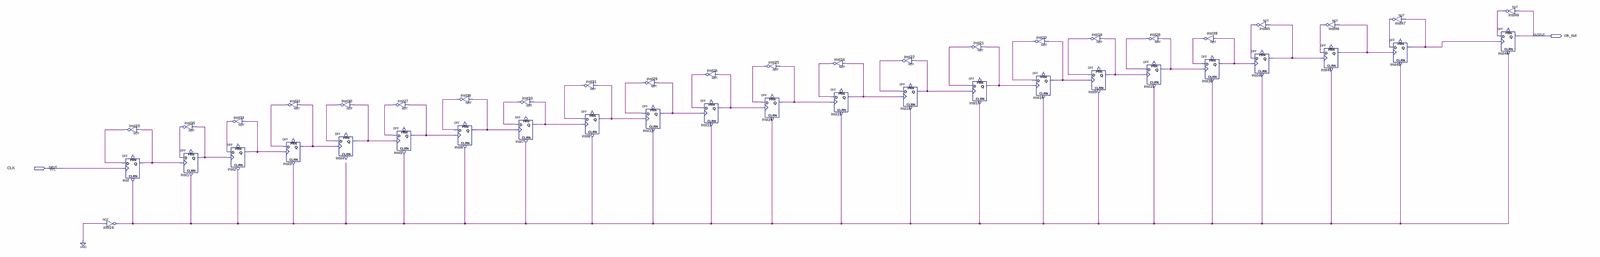
[diagram p0: schematic sheet, whole]
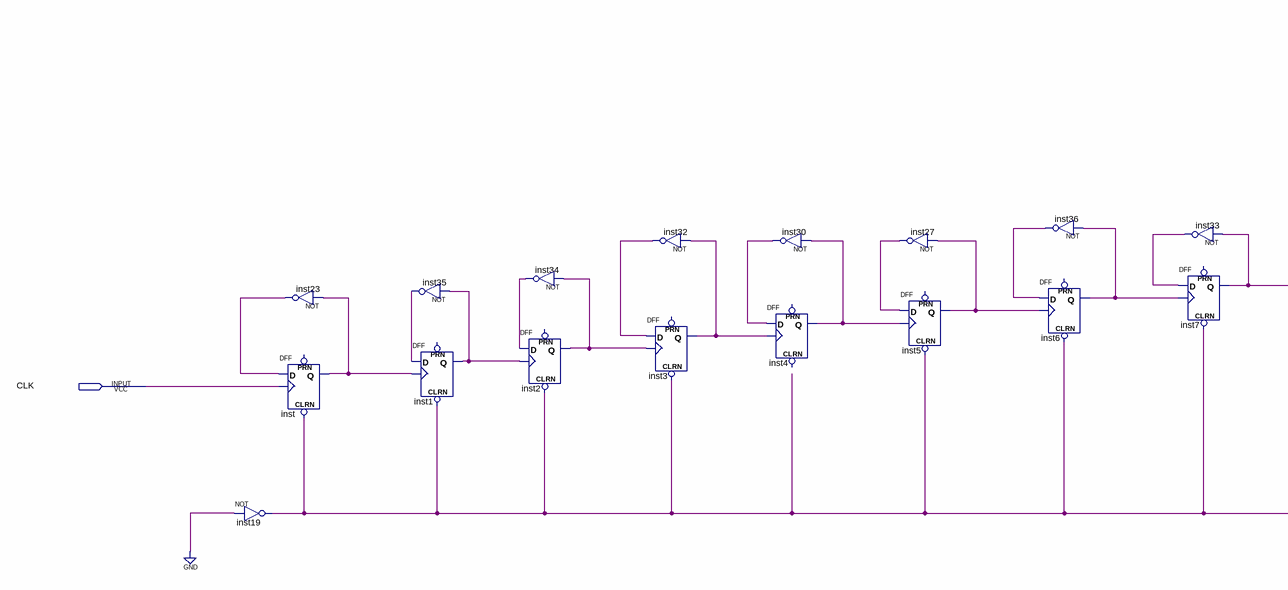
[diagram p1: schematic sheet, left part]
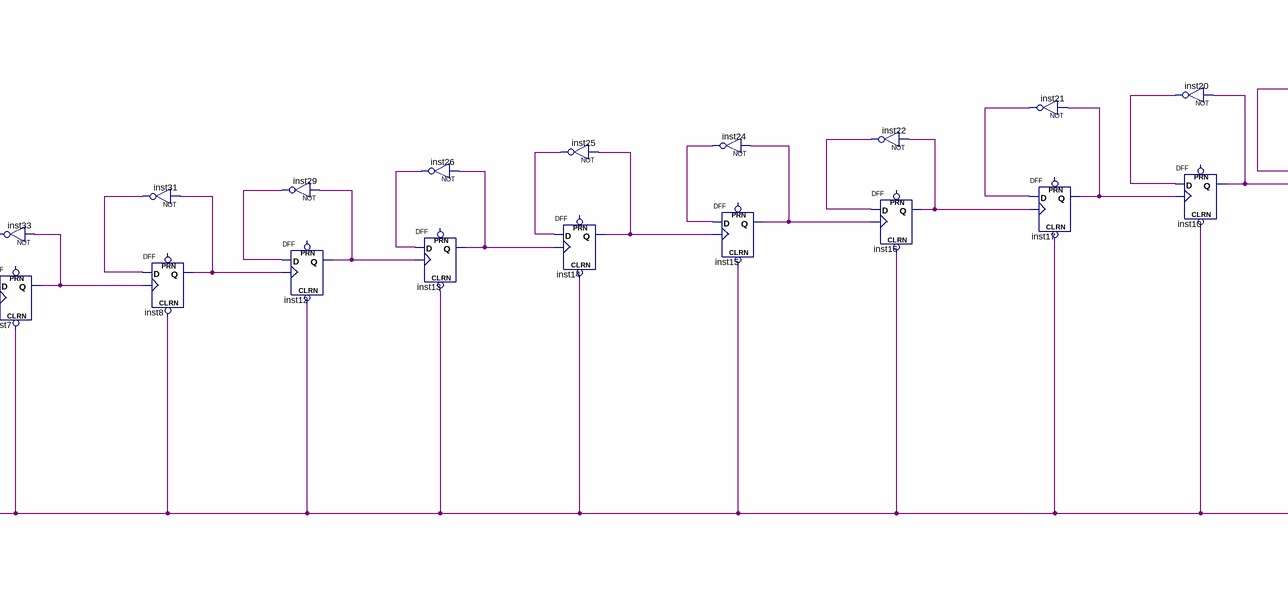
[diagram p2: schematic sheet, centre part]
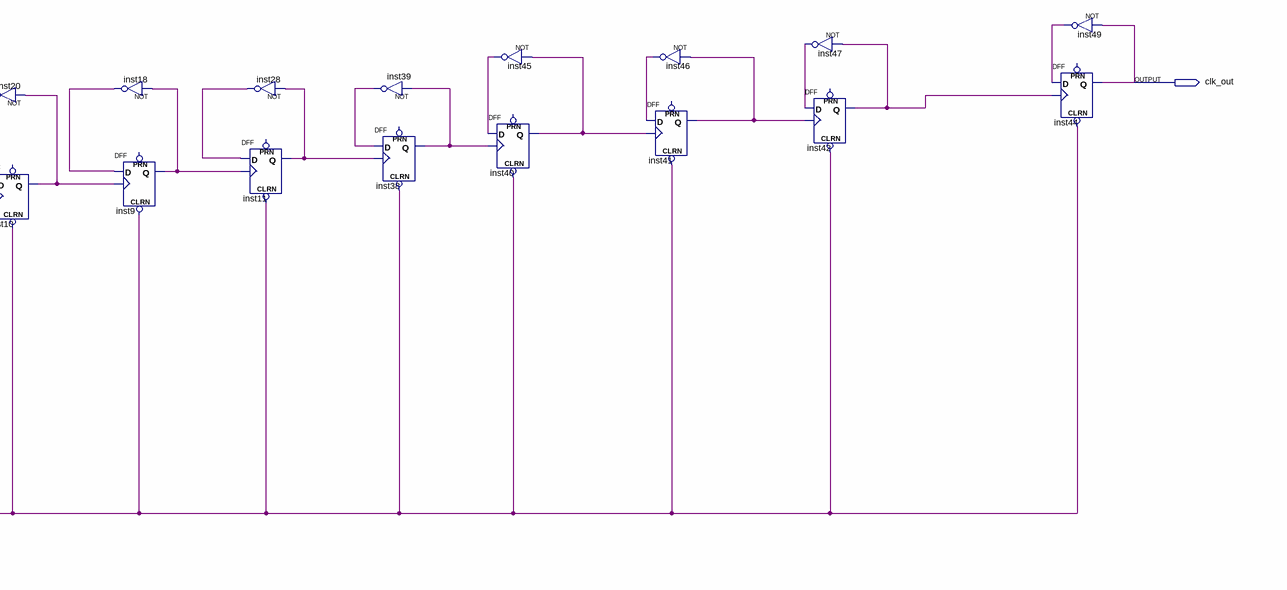
[diagram p3: schematic sheet, right part]
// Quartus schematic 100Hz_clock.bdf as structural Verilog: 47 symbols, 2 pins
module \100Hz_clock  (
  input  CLK,
  output clk_out
);

  wire inst1_q, inst2_q, inst3_q, inst4_q, inst5_q, inst6_q, inst7_q, inst8_q, inst9_q, inst10_q, inst11_q,
       inst12_q, inst13_q, inst14_q, inst15_q, inst16_q, inst17_q, inst18_out, inst19_out, inst20_out,
       inst21_out, inst22_out, inst23_out, inst24_out, inst25_out, inst26_out, inst27_out, inst28_out,
       inst29_out, inst30_out, inst31_out, inst32_out, inst33_out, inst34_out, inst35_out, inst36_out,
       inst38_q, inst39_out, inst40_q, inst41_q, inst42_q, inst45_out, inst46_out, inst47_out, inst49_out,
       inst_q;

  not inst19 (inst19_out, 1'b0);
  not inst23 (inst23_out, inst_q);
  DFF inst (.CLRN(inst19_out), .CLK(CLK), .D(inst23_out), .Q(inst_q));  // open: PRN
  not inst35 (inst35_out, inst1_q);
  DFF inst1 (.CLRN(inst19_out), .CLK(inst_q), .D(inst35_out), .Q(inst1_q));  // open: PRN
  not inst34 (inst34_out, inst2_q);
  DFF inst2 (.CLRN(inst19_out), .CLK(inst1_q), .D(inst34_out), .Q(inst2_q));  // open: PRN
  not inst32 (inst32_out, inst3_q);
  DFF inst3 (.CLRN(inst19_out), .CLK(inst2_q), .D(inst32_out), .Q(inst3_q));  // open: PRN
  not inst30 (inst30_out, inst4_q);
  DFF inst4 (.CLK(inst3_q), .D(inst30_out), .Q(inst4_q));  // open: CLRN, PRN
  not inst27 (inst27_out, inst5_q);
  DFF inst5 (.CLRN(inst19_out), .CLK(inst4_q), .D(inst27_out), .Q(inst5_q));  // open: PRN
  not inst36 (inst36_out, inst6_q);
  DFF inst6 (.CLRN(inst19_out), .CLK(inst5_q), .D(inst36_out), .Q(inst6_q));  // open: PRN
  not inst33 (inst33_out, inst7_q);
  DFF inst7 (.CLRN(inst19_out), .CLK(inst6_q), .D(inst33_out), .Q(inst7_q));  // open: PRN
  not inst31 (inst31_out, inst8_q);
  DFF inst8 (.CLRN(inst19_out), .CLK(inst7_q), .D(inst31_out), .Q(inst8_q));  // open: PRN
  not inst29 (inst29_out, inst12_q);
  DFF inst12 (.CLRN(inst19_out), .CLK(inst8_q), .D(inst29_out), .Q(inst12_q));  // open: PRN
  DFF inst13 (.CLRN(inst19_out), .CLK(inst12_q), .D(inst26_out), .Q(inst13_q));  // open: PRN
  not inst26 (inst26_out, inst13_q);
  not inst25 (inst25_out, inst14_q);
  DFF inst14 (.CLRN(inst19_out), .CLK(inst13_q), .D(inst25_out), .Q(inst14_q));  // open: PRN
  not inst24 (inst24_out, inst15_q);
  DFF inst15 (.CLRN(inst19_out), .CLK(inst14_q), .D(inst24_out), .Q(inst15_q));  // open: PRN
  not inst22 (inst22_out, inst16_q);
  DFF inst16 (.CLRN(inst19_out), .CLK(inst15_q), .D(inst22_out), .Q(inst16_q));  // open: PRN
  not inst21 (inst21_out, inst17_q);
  DFF inst17 (.CLRN(inst19_out), .CLK(inst16_q), .D(inst21_out), .Q(inst17_q));  // open: PRN
  not inst20 (inst20_out, inst10_q);
  DFF inst10 (.CLRN(inst19_out), .CLK(inst17_q), .D(inst20_out), .Q(inst10_q));  // open: PRN
  not inst18 (inst18_out, inst9_q);
  DFF inst9 (.CLRN(inst19_out), .CLK(inst10_q), .D(inst18_out), .Q(inst9_q));  // open: PRN
  DFF inst11 (.CLRN(inst19_out), .CLK(inst9_q), .D(inst28_out), .Q(inst11_q));  // open: PRN
  not inst28 (inst28_out, inst11_q);
  not inst39 (inst39_out, inst38_q);
  DFF inst38 (.CLRN(inst19_out), .CLK(inst11_q), .D(inst39_out), .Q(inst38_q));  // open: PRN
  not inst45 (inst45_out, inst40_q);
  DFF inst40 (.CLRN(inst19_out), .CLK(inst38_q), .D(inst45_out), .Q(inst40_q));  // open: PRN
  DFF inst41 (.CLRN(inst19_out), .CLK(inst40_q), .D(inst46_out), .Q(inst41_q));  // open: PRN
  not inst46 (inst46_out, inst41_q);
  not inst47 (inst47_out, inst42_q);
  DFF inst42 (.CLRN(inst19_out), .CLK(inst41_q), .D(inst47_out), .Q(inst42_q));  // open: PRN
  DFF inst44 (.CLRN(inst19_out), .CLK(inst42_q), .D(inst49_out), .Q(clk_out));  // open: PRN
  not inst49 (inst49_out, clk_out);
endmodule
